# EAGLE design DTB_BLDC_Power_Board_v2 (EAGLE 9.6.2)
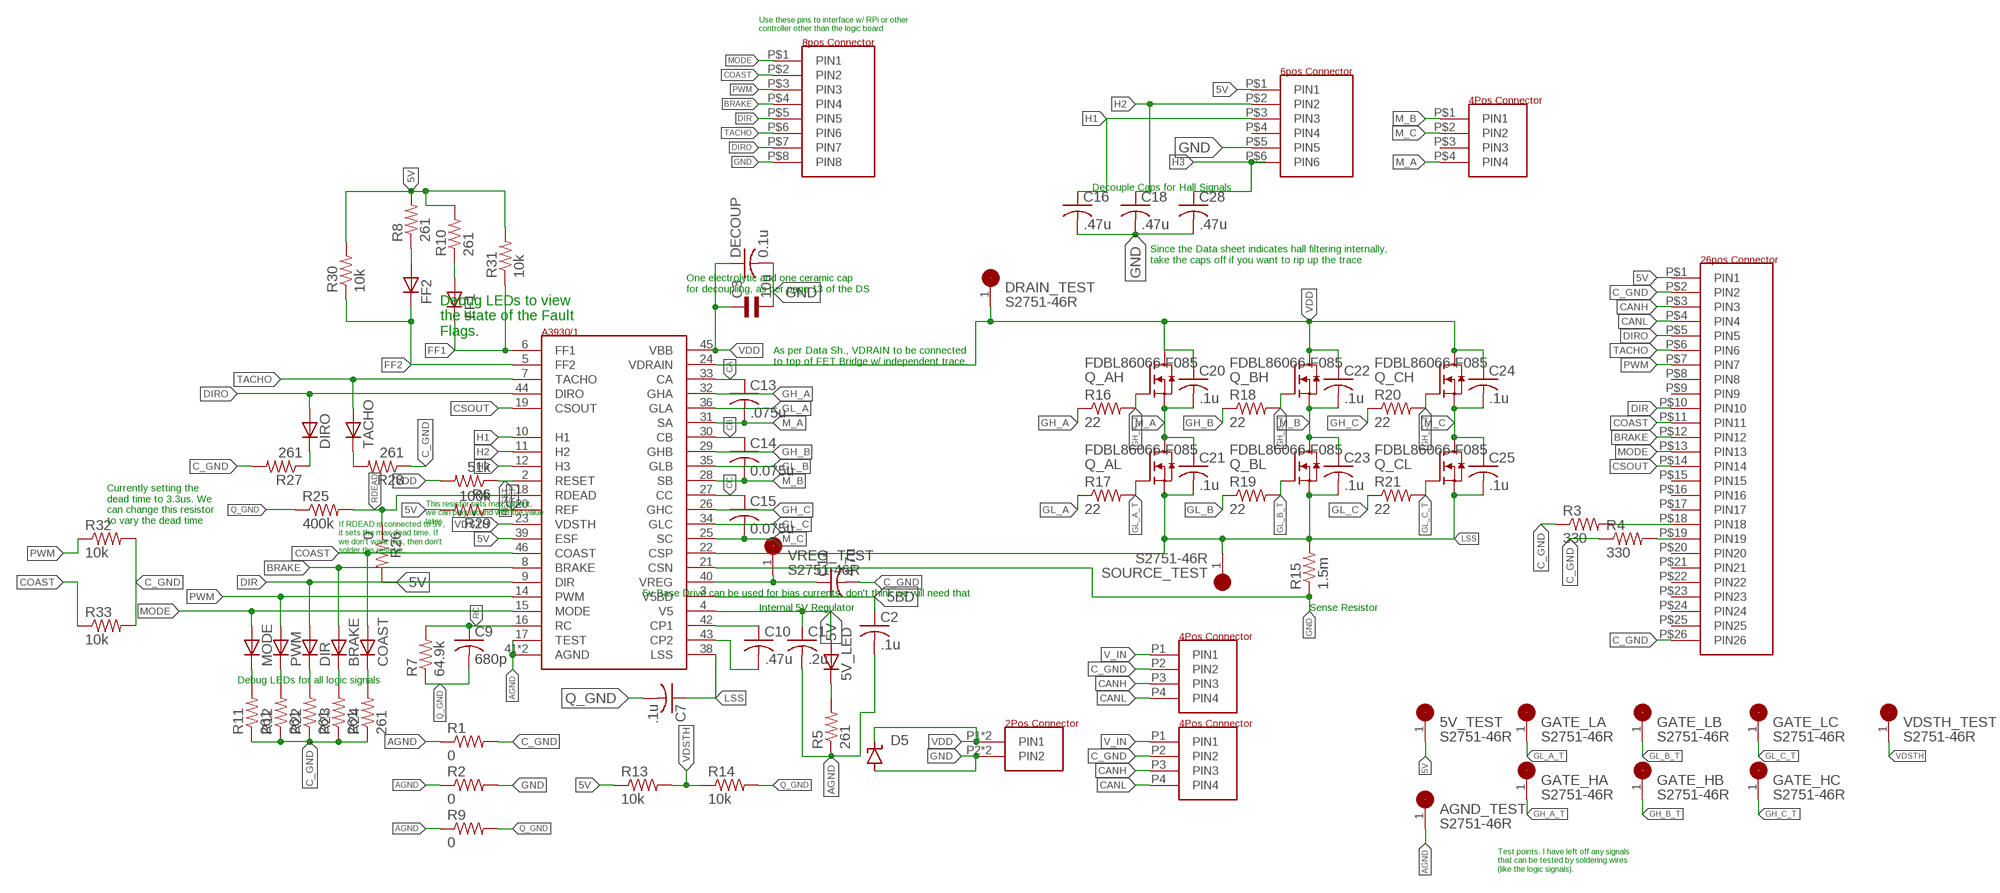
[diagram p0: schematic, sheet 1]

## Parts
5V_LED  LED0603  [DO0603]
5V_TEST  S2751-46R  [HARWIN_S2751-46R]
AGND_TEST  S2751-46R  [HARWIN_S2751-46R]
BRAKE  LED0603  [DO0603]
C1  .2u  C-USC1206K  [C1206K]
C2  .1u  C-USC1206K  [C1206K]
C3  10u  EL-BI25-10AXIAL  [EU25-10]
C7  .1u  C-USC0603  [C0603]
C9  680p  C-USC0603K  [C0603K]
C10  .47u  C-USC1206K  [C1206K]
C11  4.7u  C-USC1206K  [C1206K]
C13  .075u  C-USC1206K  [C1206K]
C14  0.075u  C-USC1206K  [C1206K]
C15  0.075u  C-USC1206K  [C1206K]
C16  .47u  C-USC0603K  [C0603K]
C18  .47u  C-USC0603K  [C0603K]
C20  .1u  C-USC1206K  [C1206K]
C21  .1u  C-USC1206K  [C1206K]
C22  .1u  C-USC1206K  [C1206K]
C23  .1u  C-USC1206K  [C1206K]
C24  .1u  C-USC1206K  [C1206K]
C25  .1u  C-USC1206K  [C1206K]
C28  .47u  C-USC0603K  [C0603K]
COAST  LED0603  [DO0603]
D5  SUPPRESSOR-SMBJ  [SMBJ]
DECOUP  0.1u  C-USC0603K  [C0603K]
DIR  LED0603  [DO0603]
DIRO  LED0603  [DO0603]
DRAIN_TEST  S2751-46R  [HARWIN_S2751-46R]
FF1  LED0603  [DO0603]
FF2  LED0603  [DO0603]
GATE_HA  S2751-46R  [HARWIN_S2751-46R]
GATE_HB  S2751-46R  [HARWIN_S2751-46R]
GATE_HC  S2751-46R  [HARWIN_S2751-46R]
GATE_LA  S2751-46R  [HARWIN_S2751-46R]
GATE_LB  S2751-46R  [HARWIN_S2751-46R]
GATE_LC  S2751-46R  [HARWIN_S2751-46R]
J1  26POS_CONNECTORN2526-6002-RB  [N2526-6002-RB]
J2  4POS_MOLEX_MEGAFIT5.7  [MOLEX_MEGAFIT5.7_1720650204]
J3  6POS_MOLEX_MINIFIT4.2  [MOLEX_MINIFIT4.2_0460150606]
J4  4POS_CONNECTORMOLEX_MICROFIT3.0_0430450412  [MOLEX_MICROFIT3.0_0430450412]
J5  4POS_CONNECTORMOLEX_MICROFIT3.0_0430450412  [MOLEX_MICROFIT3.0_0430450412]
J6  2POS_CONNECTORPOWERPOLE_45_1X2_VERT  [POWERPOLE_45A_1X2_VERT]
MODE  LED0603  [DO0603]
PWM  LED0603  [DO0603]
Q_AH  FDBL86066-F085  N-FETPG-HSOF-8-1  [PG-HSOF-8-1]
Q_AL  FDBL86066-F085  N-FETPG-HSOF-8-1  [PG-HSOF-8-1]
Q_BH  FDBL86066-F085  N-FETPG-HSOF-8-1  [PG-HSOF-8-1]
Q_BL  FDBL86066-F085  N-FETPG-HSOF-8-1  [PG-HSOF-8-1]
Q_CH  FDBL86066-F085  N-FETPG-HSOF-8-1  [PG-HSOF-8-1]
Q_CL  FDBL86066-F085  N-FETPG-HSOF-8-1  [PG-HSOF-8-1]
R1  0  R-US_R1206  [R1206]
R2  0  R-US_R1206  [R1206]
R3  330  R-US_R0603  [R0603]
R4  330  R-US_R0603  [R0603]
R5  261  R-US_R0603  [R0603]
R6  51k  R-US_R0603  [R0603]
R7  64.9k  R-US_R0603  [R0603]
R8  261  R-US_R0603  [R0603]
R9  0  R-US_R1206  [R1206]
R10  261  R-US_R0603  [R0603]
R11  261  R-US_R0603  [R0603]
R12  261  R-US_R0603  [R0603]
R13  10k  R-US_R0603  [R0603]
R14  10k  R-US_R0603  [R0603]
R15  1.5m  R-US_R2512  [R2512]
R16  22  R-US_R1206  [R1206]
R17  22  R-US_R1206  [R1206]
R18  22  R-US_R1206  [R1206]
R19  22  R-US_R1206  [R1206]
R20  22  R-US_R1206  [R1206]
R21  22  R-US_R1206  [R1206]
R22  261  R-US_R0603  [R0603]
R23  261  R-US_R0603  [R0603]
R24  261  R-US_R0603  [R0603]
R25  400k  R-US_R0603  [R0603]
R26  0  R-US_R0603  [R0603]
R27  261  R-US_R0603  [R0603]
R28  261  R-US_R0603  [R0603]
R29  100k  R-US_R0603  [R0603]
R30  10k  R-US_R0603  [R0603]
R31  10k  R-US_R0603  [R0603]
R32  10k  R-US_R0603  [R0603]
R33  10k  R-US_R0603  [R0603]
SOURCE_TEST  S2751-46R  [HARWIN_S2751-46R]
TACHO  LED0603  [DO0603]
U1  A3930/1  [QFP50P900X900X160-49T500]
U$13  8POS_CONNECTOR8POS_HEADER_0.1"  [8POS_HEADER_.1"]
VDSTH_TEST  S2751-46R  [HARWIN_S2751-46R]
VREG_TEST  S2751-46R  [HARWIN_S2751-46R]

## Nets
5BD: C2.1 U1.3(V5BD)
5V: 5V_LED.1(A) 5V_TEST.1(TP) C1.1 J1.P$1(PIN1) J3.P$1(PIN1) R8.2 R10.2 R13.1 R26.2 R29.2 R30.2 R31.2 U1.4(V5) U1.39(ESF)
AGND: AGND_TEST.1(TP) C1.2 C2.2 R1.1 R2.1 R5.1 R9.1 U1.17(TEST) U1.41(AGND) U1.49(AGND)
BRAKE: BRAKE.1(A) J1.P$12(PIN12) U1.8(BRAKE) U$13.P$4(PIN4)
C_GND: C11.2 J1.P$2(PIN2) J1.P$26(PIN26) J4.P2(PIN2) J5.P2(PIN2) R1.2 R3.1 R4.1 R11.1 R12.1 R22.1 R23.1 R24.1 R27.2 R28.1 R32.2 R33.2
CA: C13.1 U1.33(CA)
CANH: J1.P$3(PIN3) J4.P3(PIN3) J5.P3(PIN3)
CANL: J1.P$4(PIN4) J4.P4(PIN4) J5.P4(PIN4)
CB: C14.1 U1.30(CB)
CC: C15.1 U1.27(CC)
COAST: COAST.1(A) J1.P$11(PIN11) R33.1 U1.46(COAST) U$13.P$2(PIN2)
CSOUT: J1.P$14(PIN14) U1.19(CSOUT)
DIR: DIR.1(A) J1.P$10(PIN10) U1.9(DIR) U$13.P$5(PIN5)
DIRO: DIRO.1(A) J1.P$5(PIN5) U1.44(DIRO) U$13.P$7(PIN7)
FF1: FF1.2(C) R31.1 U1.6(FF1)
FF2: FF2.2(C) R30.1 U1.5(FF2)
GH_A: R16.1 U1.32(GHA)
GH_A_T: GATE_HA.1(TP) Q_AH.P$4(G) R16.2
GH_B: R18.1 U1.29(GHB)
GH_B_T: GATE_HB.1(TP) Q_BH.P$4(G) R18.2
GH_C: R20.1 U1.26(GHC)
GH_C_T: GATE_HC.1(TP) Q_CH.P$4(G) R20.2
GL_A: R17.1 U1.36(GLA)
GL_A_T: GATE_LA.1(TP) Q_AL.P$4(G) R17.2
GL_B: R19.1 U1.35(GLB)
GL_B_T: GATE_LB.1(TP) Q_BL.P$4(G) R19.2
GL_C: R21.1 U1.34(GLC)
GL_C_T: GATE_LC.1(TP) Q_CL.P$4(G) R21.2
GND: C3.2 C16.2 C18.2 C28.2 D5.A DECOUP.2 J3.P$5(PIN5) J6.P2(PIN2) J6.P2B(PIN2) R2.2 R15.1 U1.21(CSN) U$13.P$8(PIN8)
H1: C16.1 J3.P$3(PIN3) U1.10(H1)
H2: C18.1 J3.P$2(PIN2) U1.11(H2)
H3: C28.1 J3.P$6(PIN6) U1.12(H3)
LSS: C7.1 C21.2 C23.2 C25.2 Q_AL.P$5(S) Q_AL.P$6(S) Q_AL.P$7(S) Q_AL.P$8(S) Q_AL.P$9(S) Q_AL.P$10(S) Q_AL.P$11(S) Q_AL.P$12(S) Q_BL.P$5(S) Q_BL.P$6(S) Q_BL.P$7(S) Q_BL.P$8(S) Q_BL.P$9(S) Q_BL.P$10(S) Q_BL.P$11(S) Q_BL.P$12(S) Q_CL.P$5(S) Q_CL.P$6(S) Q_CL.P$7(S) Q_CL.P$8(S) Q_CL.P$9(S) Q_CL.P$10(S) Q_CL.P$11(S) Q_CL.P$12(S) R15.2 SOURCE_TEST.1(TP) U1.22(CSP) U1.38(LSS)
M_A: C13.2 C20.2 C21.1 J2.P$4(PIN4) Q_AH.P$5(S) Q_AH.P$6(S) Q_AH.P$7(S) Q_AH.P$8(S) Q_AH.P$9(S) Q_AH.P$10(S) Q_AH.P$11(S) Q_AH.P$12(S) Q_AL.P$1(D) Q_AL.P$2(D) Q_AL.P$3(D) U1.31(SA)
M_B: C14.2 C22.2 C23.1 J2.P$1(PIN1) Q_BH.P$5(S) Q_BH.P$6(S) Q_BH.P$7(S) Q_BH.P$8(S) Q_BH.P$9(S) Q_BH.P$10(S) Q_BH.P$11(S) Q_BH.P$12(S) Q_BL.P$1(D) Q_BL.P$2(D) Q_BL.P$3(D) U1.28(SB)
M_C: C15.2 C24.2 C25.1 J2.P$2(PIN2) Q_CH.P$5(S) Q_CH.P$6(S) Q_CH.P$7(S) Q_CH.P$8(S) Q_CH.P$9(S) Q_CH.P$10(S) Q_CH.P$11(S) Q_CH.P$12(S) Q_CL.P$1(D) Q_CL.P$2(D) Q_CL.P$3(D) U1.25(SC)
MODE: J1.P$13(PIN13) MODE.1(A) U1.15(MODE) U$13.P$1(PIN1)
N$1: J1.P$18(PIN18) R3.2
N$2: J1.P$19(PIN19) R4.2
N$3: C10.1 U1.42(CP1)
N$4: C10.2 U1.43(CP2)
N$5: FF1.1(A) R10.1
N$13: 5V_LED.2(C) R5.2
N$18: FF2.1(A) R8.1
N$22: DIRO.2(C) R27.1
N$23: R28.2 TACHO.2(C)
N$24: MODE.2(C) R11.2
N$25: PWM.2(C) R12.2
N$26: DIR.2(C) R22.2
N$27: BRAKE.2(C) R23.2
N$28: COAST.2(C) R24.2
PWM: J1.P$7(PIN7) PWM.1(A) R32.1 U1.14(PWM) U$13.P$3(PIN3)
Q_GND: C7.2 C9.2 R7.1 R9.2 R14.2 R25.1
RC: C9.1 R7.2 U1.16(RC)
RDEAD: R25.2 R26.1 U1.18(RDEAD)
REF: R29.1 U1.20(REF)
RESET: R6.1 U1.2(RESET)
TACHO: J1.P$6(PIN6) TACHO.1(A) U1.7(TACHO) U$13.P$6(PIN6)
V_IN: J4.P1(PIN1) J5.P1(PIN1)
VDD: C3.1 C20.1 C22.1 C24.1 D5.C DECOUP.1 DRAIN_TEST.1(TP) J6.P1(PIN1) J6.P1B(PIN1) Q_AH.P$1(D) Q_AH.P$2(D) Q_AH.P$3(D) Q_BH.P$1(D) Q_BH.P$2(D) Q_BH.P$3(D) Q_CH.P$1(D) Q_CH.P$2(D) Q_CH.P$3(D) R6.2 U1.24(VDRAIN) U1.45(VBB)
VDSTH: R13.2 R14.1 U1.23(VDSTH) VDSTH_TEST.1(TP)
VREG: C11.1 U1.40(VREG) VREG_TEST.1(TP)
Unconnected: J1.P$8(PIN8) J1.P$9(PIN9) J1.P$15(PIN15) J1.P$16(PIN16) J1.P$17(PIN17) J1.P$20(PIN20) J1.P$21(PIN21) J1.P$22(PIN22) J1.P$23(PIN23) J1.P$24(PIN24) J1.P$25(PIN25) J2.P$3(PIN3) J3.P$4(PIN4)

## Notes on the sheet
- Use these pins to interface w/ RPi or other
  controller other than the logic board
- Decouple Caps for Hall Signals
- Since the Data sheet indicates hall filtering internally, 
  take the caps off if you want to rip up the trace
- One electrolytic and one ceramic cap
  for decoupling, as per page 13 of the DS
- Debug LEDs to view
  the state of the Fault
  Flags.
- As per Data Sh., VDRAIN to be connected
  to top of FET Bridge w/ independent trace.
- Currently setting the 
  dead time to 3.3us. We
  can change this resistor
  to vary the dead time
- This resistor sets max current,
  we can play around with the value
  later
- If RDEAD is connected to 5V,
  it sets the max dead time. If
  we don't want this, then don't
  solder this resistor.
- 5v Base Drive can be used for bias currents, don't think we will need that
- Internal 5V Regulator | Sense Resistor
- Debug LEDs for all logic signals
- Test points. I have left off any signals
  that can be tested by soldering wires
  (like the logic signals).

## Library data of the parts
5V_LED BRAKE COAST DIR DIRO FF1 FF2 MODE PWM TACHO = CMR:LED0603: LED size 0603 for debugging pic
5V_TEST AGND_TEST DRAIN_TEST GATE_HA GATE_HB GATE_HC GATE_LA GATE_LB GATE_LC SOURCE_TEST VDSTH_TEST VREG_TEST = CMR:S2751-46R: EZ-Test Point, SMT, tin, Tape and Reeled Check prices <https://pricing.snapeda.com/parts/S2751-46R/Harwin%20Inc./view-part?ref=eda>; AVAILABILITY: In Stock; DESCRIPTION: Natural PC Test Point Brass, Tin Plating Surface Mount Mounting Type; MF: Harwin Inc.; MP: S2751-46R; PACKAGE: None; PRICE: None; PURCHASE-URL: https://pricing.snapeda.com/search/part/S2751-46R/?ref=eda
C1 C2 C7 C9-C11 C13-C16 C18 C20-C25 C28 DECOUP = rcl:C-US: CAPACITOR, American symbol; SPICEPREFIX: C
C3 = rcl:EL-: BIPOLAR ELECTROLYTIC CAPACITOR; SPICEPREFIX: C
D5 = diode:SUPPRESSOR-: Suppressor diode
J1 = CMR:26POS_CONNECTOR
J2 = CMR:4POS_MOLEX_MEGAFIT5.7
J3 = CMR:6POS_MOLEX_MINIFIT4.2
J4 J5 = CMR:4POS_CONNECTOR: 4 position connector could be header or connector
J6 = CMR:2POS_CONNECTOR: Harwin 2mm 2 POS Connector Male - https://www.digikey.com/product-detail/en/harwin-inc/M80-8520242/952-1769-ND/3727738 Female - https://www.digikey.com/product-detail/en/harwin-inc/M80-8980205/952-1182-ND/2264171
Q_AH Q_AL Q_BH Q_BL Q_CH Q_CL = CMR:N-FET: 150A MOSFET (probably can't sustain the 150A continuous)
R1-R33 = rcl:R-US_: RESISTOR, American symbol; SPICEPREFIX: R
U1 = CMR:A3930/1
U$13 = CMR:8POS_CONNECTOR: Arbitrary 8 position connector

## Board
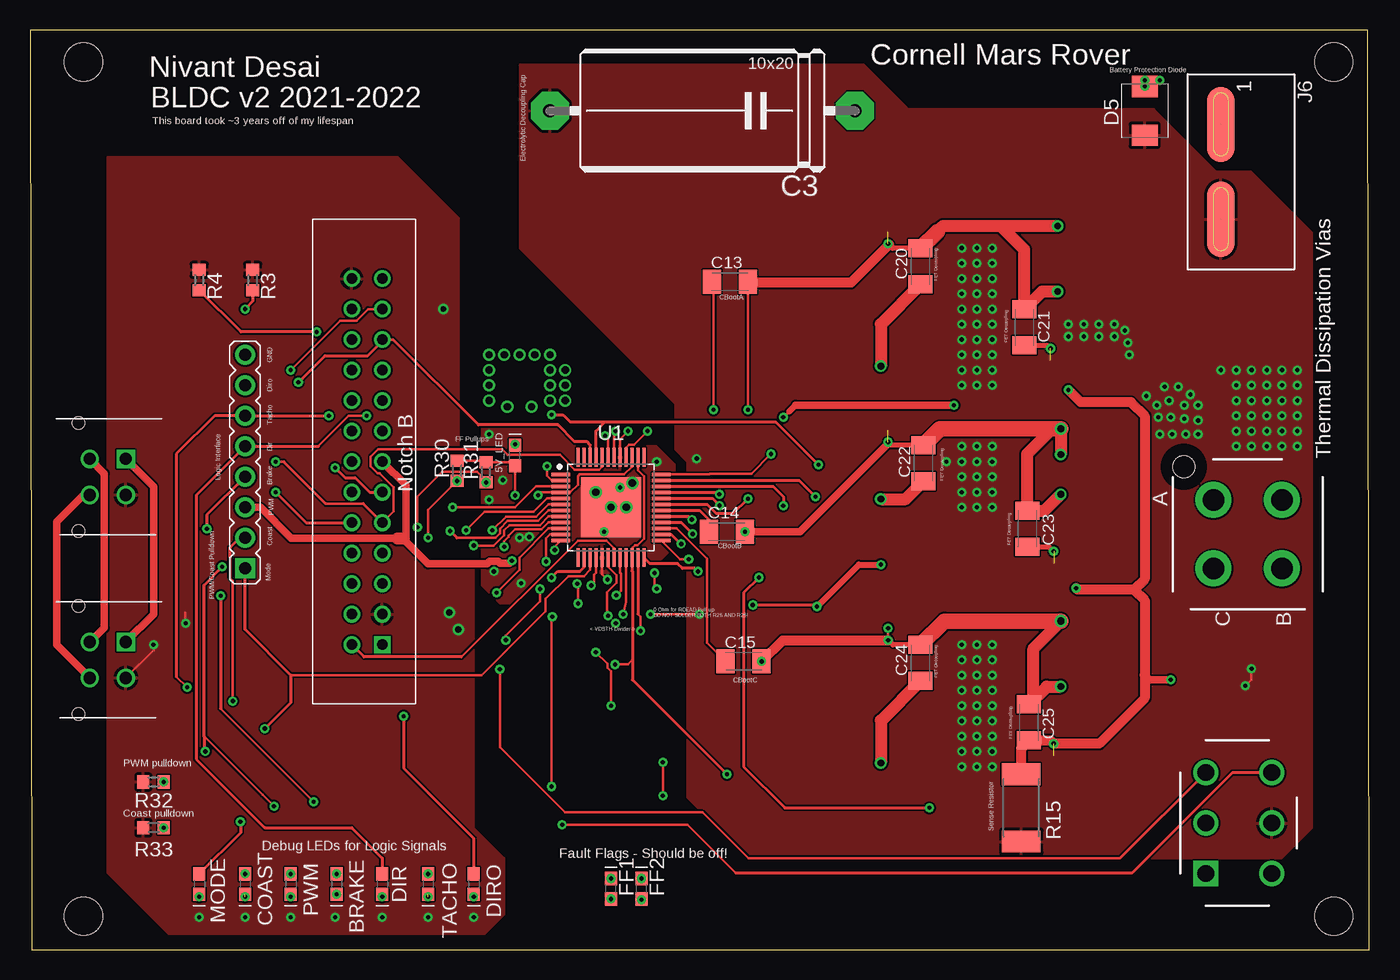
[diagram p1: board, top side]
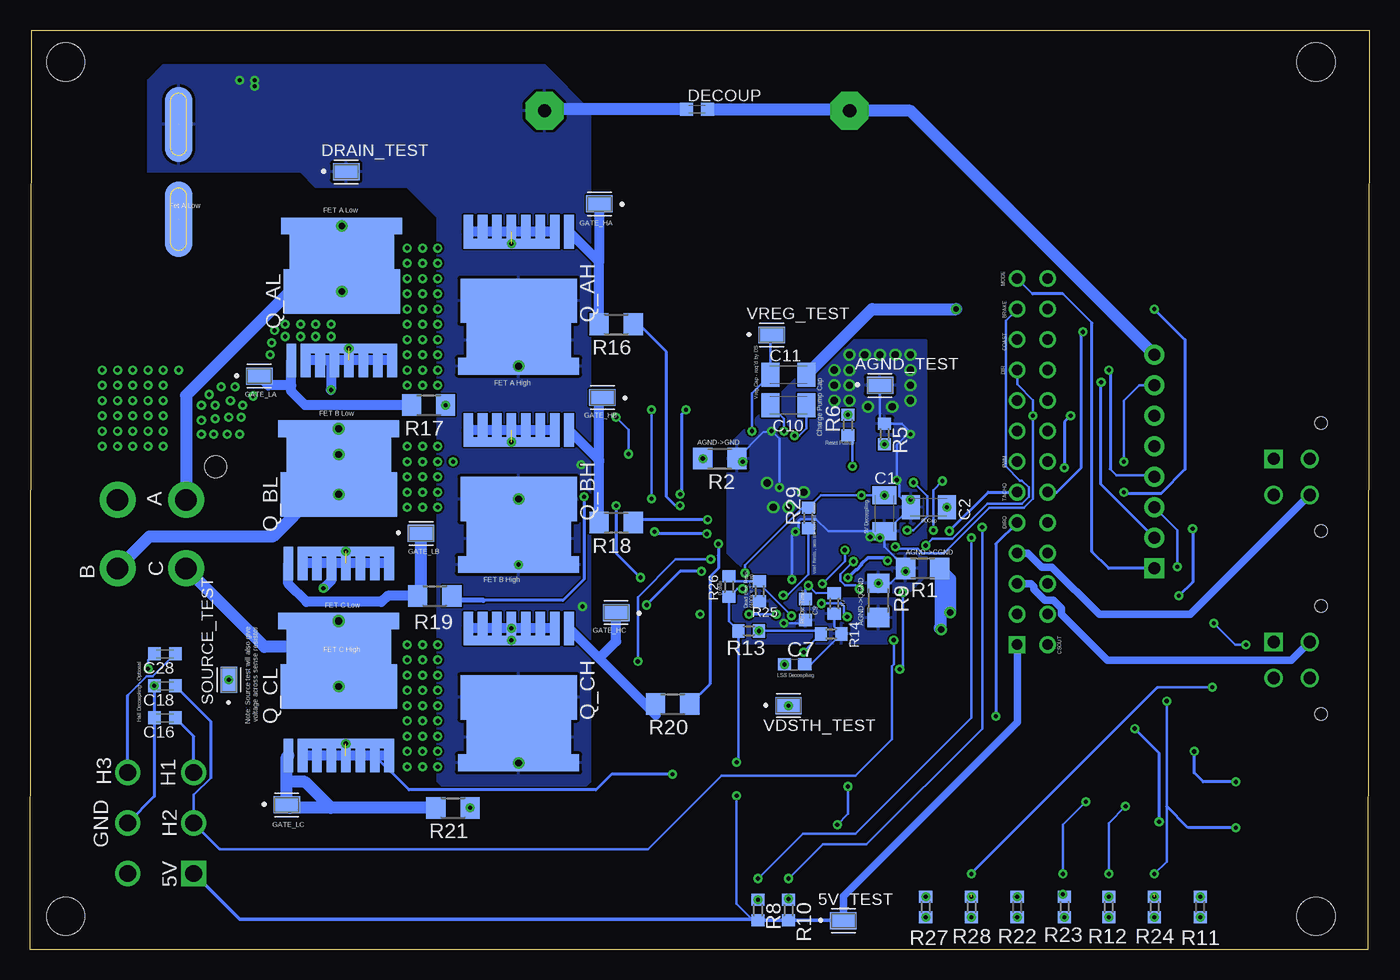
[diagram p2: board, bottom side, seen from below]

Size 111.56 x 76.57 mm. Coordinates in mm from the lower left corner, seen from the top.
Outline: 0.13,0 111.56,0 111.43,76.57 0,76.57 0.13,0
Copper layers (1*16): Top 0.035mm / dielectric 1.5mm / Bottom 0.035mm
Design rules "default": minimum track width 6mil, minimum drill 0.35mm, track to track 6mil, track to pad 6mil, pad to pad 6mil, via to via 6mil, smd to smd 6mil, copper to edge 40mil, drill to drill 6mil, minimum pad ring 10mil, minimum via ring 8mil, stop-mask expansion 4mil, vias tented up to drill 0mil, thermal gap 10mil
Holes 3.17 mm at 4.44,73.91 4.44,2.79 108.58,2.79 108.58,73.91

### Footprints (pad centres in the part's own frame; a part is rotated, then mirrored left to right if it is on the bottom)
DO0603 = smd 1.1 x 1: 1 -0.85,0; 2 0.85,0
HARWIN_S2751-46R = smd 2.2 x 1.4: 1 0,0
C1206K = smd 1.5 x 2: 1 -1.5,0; 2 1.5,0
EU25-10 = drill 1.118 pad 3.15 octagon: 1 -12.7,0; 2 12.7,0
C0603 = smd 1.1 x 1: 1 -0.85,0; 2 0.85,0
C0603K = smd 1.05 x 1.08: 1 -0.875,0; 2 0.875,0
SMBJ = smd 1.78 x 2.16: A 2.04,0; C -2.03,0
N2526-6002-RB = drill 0.889 square: P$1 0,0 | drill 0.889: P$2 2.54,0; P$3 5.08,0; P$4 7.62,0; P$5 10.16,0; P$6 12.7,0; P$7 15.24,0; P$8 17.78,0; P$9 20.32,0; P$10 22.86,0; P$11 25.4,0; P$12 27.94,0; P$13 30.48,0; P$14 0,2.54; P$15 2.54,2.54; P$16 5.08,2.54; P$17 7.62,2.54; P$18 10.16,2.54; P$19 12.7,2.54; P$20 15.24,2.54; P$21 17.78,2.54; P$22 20.32,2.54; P$23 22.86,2.54; P$24 25.4,2.54; P$25 27.94,2.54; P$26 30.48,2.54
MOLEX_MEGAFIT5.7_1720650204 = drill 1.8 pad 3: P$1 0,0; P$2 5.7,0; P$3 0,-5.7; P$4 5.7,-5.7 | hole 1.8: 8.18,-8.47
MOLEX_MINIFIT4.2_0460150606 = drill 1.4 square: P$1 0,0 | drill 1.4: P$2 4.2,0; P$3 8.4,0; P$4 0,-5.5; P$5 4.2,-5.5; P$6 8.4,-5.5
MOLEX_MICROFIT3.0_0430450412 = drill 1.02 square: P1 1.5,-1.5 | drill 1.02: P2 -1.5,-1.5; P3 1.5,1.5; P4 -1.5,1.5 | hole 1.02: -4.5,2.44; 4.5,2.44
POWERPOLE_45A_1X2_VERT = smd 6.246 x 2.286: P1 -3.95,0; P2 3.95,0 | smd 6.246 x 2.286 bottom: P1B -3.95,0; P2B 3.95,0
PG-HSOF-8-1 = smd 10.1 x 1.4: P$1 0,7.3 | smd 8.7 x 2.9: P$2 0,5.15 | smd 9.7 x 3.7: P$3 0,1.85 | smd 0.8 x 2.8: P$4 -4.2,-3.9; P$5 -3,-3.9; P$6 -1.8,-3.9; P$7 -0.6,-3.9; P$8 0.6,-3.9; P$9 1.8,-3.9; P$10 3,-3.9; P$11 4.2,-3.9 | smd 8 x 0.8: P$12 0.6,-2.9
R1206 = smd 1.6 x 1.803: 1 -1.422,0; 2 1.422,0
R0603 = smd 1 x 1.1: 1 -0.85,0; 2 0.85,0
R2512 = smd 1.8 x 3.2: 1 -2.8,0; 2 2.8,0
QFP50P900X900X160-49T500 = smd 1.559 x 0.28: 1 -4.178,2.75; 2 -4.178,2.25; 3 -4.178,1.75; 4 -4.178,1.25; 5 -4.178,0.75; 6 -4.178,0.25; 7 -4.178,-0.25; 8 -4.178,-0.75; 9 -4.178,-1.25; 10 -4.178,-1.75; 11 -4.178,-2.25; 12 -4.178,-2.75; 25 4.178,-2.75; 26 4.178,-2.25; 27 4.178,-1.75; 28 4.178,-1.25; 29 4.178,-0.75; 30 4.178,-0.25; 31 4.178,0.25; 32 4.178,0.75; 33 4.178,1.25; 34 4.178,1.75; 35 4.178,2.25; 36 4.178,2.75 | smd 0.28 x 1.559: 13 -2.75,-4.178; 14 -2.25,-4.178; 15 -1.75,-4.178; 16 -1.25,-4.178; 17 -0.75,-4.178; 18 -0.25,-4.178; 19 0.25,-4.178; 20 0.75,-4.178; 21 1.25,-4.178; 22 1.75,-4.178; 23 2.25,-4.178; 24 2.75,-4.178; 37 2.75,4.178; 38 2.25,4.178; 39 1.75,4.178; 40 1.25,4.178; 41 0.75,4.178; 42 0.25,4.178; 43 -0.25,4.178; 44 -0.75,4.178; 45 -1.25,4.178; 46 -1.75,4.178; 47 -2.25,4.178; 48 -2.75,4.178 | smd 5 x 5: 49 0,0
8POS_HEADER_.1" = drill 0.991 pad 1.676 square: P$1 0,0 | drill 0.991 pad 1.676: P$2 2.54,0; P$3 5.08,0; P$4 7.62,0; P$5 10.16,0; P$6 12.7,0; P$7 15.24,0; P$8 17.78,0

### Placement (x,y rotation side)
5V_LED  40.39,41.15 90 top
5V_TEST  43.82,2.41 0 bottom
AGND_TEST  40.77,46.99 0 bottom
BRAKE  25.53,5.46 270 top
C1  40.39,36.32 270 bottom
C2  36.7,36.83 180 bottom
C3  56.01,69.85 180 top
C7  47.88,23.75 0 bottom
C9  46.99,28.32 270 bottom
C10  48.39,45.34 0 bottom
C11  48.39,47.88 0 bottom
C13  58.29,55.63 0 top
C14  58.04,34.8 0 top
C15  59.44,24 0 top
C16  100.33,19.3 180 bottom
C18  100.33,21.97 180 bottom
C20  74.17,56.9 90 top
C21  82.8,51.82 270 top
C22  74.42,40.51 90 top
C23  83.06,35.05 270 top
C24  74.17,23.88 90 top
C25  83.19,18.92 270 top
C28  100.33,24.64 180 bottom
COAST  17.91,5.46 270 top
D5  92.84,69.85 270 top
DECOUP  56.01,69.98 0 bottom
DIR  29.34,5.46 270 top
DIRO  36.96,5.46 270 top
DRAIN_TEST  85.22,64.77 0 bottom
FF1  48.39,5.08 90 top
FF2  50.93,5.08 90 top
GATE_HA  64.13,62.1 180 bottom
GATE_HB  63.88,45.97 180 bottom
GATE_HC  62.74,28.07 180 bottom
GATE_LA  92.46,47.75 0 bottom
GATE_LB  78.99,34.67 0 bottom
GATE_LC  90.17,12.06 0 bottom
J1  29.34,25.4 90 top
J2  104.27,31.75 180 top
J3  97.92,6.35 90 top
J4  6.48,24.13 90 top
J5  6.48,39.37 90 top
J6  99.19,64.77 270 top
MODE  14.1,5.46 270 top
PWM  21.72,5.46 270 top
Q_AH  70.87,55.88 180 bottom
Q_AL  85.6,52.96 0 bottom
Q_BH  70.87,39.37 180 bottom
Q_BL  85.85,36.07 0 bottom
Q_CH  70.87,22.86 180 bottom
Q_CL  85.85,20.07 0 bottom
R1  37.21,31.75 0 bottom
R2  54.1,40.89 180 bottom
R3  18.54,55.75 270 top
R4  14.1,55.75 270 top
R5  40.39,42.93 270 bottom
R6  43.43,43.69 90 bottom
R7  44.58,28.83 90 bottom
R8  50.93,3.3 270 bottom
R9  40.89,29.08 270 bottom
R10  48.39,3.3 270 bottom
R11  14.1,3.56 90 bottom
R12  21.72,3.56 90 bottom
R13  51.69,26.54 0 bottom
R14  44.83,26.29 0 bottom
R15  82.55,11.81 90 top
R16  62.74,52.07 180 bottom
R17  78.36,45.34 180 bottom
R18  62.74,35.56 180 bottom
R19  77.85,29.46 180 bottom
R20  58.04,20.45 180 bottom
R21  76.33,11.81 180 bottom
R22  29.34,3.56 90 bottom
R23  25.4,3.56 90 bottom
R24  17.91,3.56 90 bottom
R25  50.8,29.84 90 bottom
R26  53.34,30.23 270 bottom
R27  36.96,3.56 270 bottom
R28  33.15,3.56 90 bottom
R29  46.74,35.94 90 bottom
R30  35.56,39.88 90 top
R31  37.97,39.75 90 top
R32  10.29,13.97 180 top
R33  10.29,10.16 180 top
SOURCE_TEST  95,22.48 90 bottom
TACHO  33.15,5.46 270 top
U1  48.39,36.83 0 top
U$13  17.91,31.75 90 top
VDSTH_TEST  48.39,20.32 0 bottom
VREG_TEST  49.78,51.18 0 bottom

### Tracks (layer width: path | path; a pad name or v marks a point on that pad's centre or on a via)
5BD  (via drill 0.35)
  Top 0.203: U1.3 42.16,38.58 40.41,36.83 C2.1
  other vias: 35.2,36.83
5V  (via drill 0.35)
  Top 0.203: v42.32,37.84 42.55,38.08 U1.4 44.99,38.08 45.63,38.73 45.63,39.44 45.78,39.58 49.49,39.58 50.14,40.23 U1.39 | C1.1 5V_LED.1 40.08,40.6 38.23,40.6 | R31.2 38.23,40.6 | R30.2 38.1,40.73 38.23,40.6 | v52.2,30.06 52.01,30.25 v52.01,31.37 | v52.71,15.62 v52.71,12.83
  Bottom 0.203: C1.1 40.41,37.84 v42.32,37.84 45.69,37.84 R29.2 47.22,36.79 52.01,32 v52.01,31.37 | v52.2,30.06 52.65,30.06 R26.2 53.34,27.34 R13.1 52.54,15.79 v52.71,15.62 | v52.71,12.83 52.71,3.81 51.44,2.54
  Bottom 0.305: J3.P$1 94.11,2.54 51.44,2.54 51.02,2.54 R8.2 R10.2 43.85,2.45 5V_TEST.1
  Bottom 0.61: 5V_TEST.1 43.82,4.45 29.34,18.92 J1.P$1
  other vias: 40.39,37.82
AGND  (via drill 0.35, 0.6)
  Top 0.203: U1.17 47.64,31.28 v48.09,30.83 | U1.41 49.14,42.51 v49.8,43.18
  Bottom 0.152: R9.1 40.89,31.11 | R2.1 50.47,43.11 49.73,43.11
  Bottom 0.203: 38.35,43.05 v38.23,42.93 | C2.2 38.23,36.85 v38.23,37.46 | C1.2 40.77,34.44 v40.77,34.29 | R1.1 v38.63,31.5 | R2.1 52.45,40.89 v52.2,40.64 | AGND_TEST.1 40.77,44.16 R5.1 38.95,43.78 38.29,43.12 38.35,43.05 | v48.09,30.83 48.09,34.52 v47.82,34.8 47.54,35.08 47.54,35.7 47.39,35.84 46.08,35.84 45.06,34.82 C1.2 | C1.2 40.84,34.37 v41.58,34.37 | v49.8,43.18 49.73,43.11 49.15,42.52 v49.15,38.48 | C2.2 39.13,37.76 39.13,38.68 39.37,38.91 v39.37,39.1 39.37,42.04 38.35,43.05 | R1.1 39.88,30.5 R9.1 | R1.1 39.5,32.62 39.5,32.65 40.39,33.53 C1.2 | C2.2 40.21,34.82 C1.2
  other vias: 40.89,30.5 38.23,49.53 38.23,48.26 38.23,46.99 38.23,45.72 39.75,45.21 41.78,45.21 43.31,45.72 44.58,45.72 43.31,46.99 44.58,46.99 44.58,48.26 43.31,48.26 43.31,49.53 42.04,49.53 40.77,49.53 39.5,49.53 48.39,36.83 47.12,38.1 49.66,36.83 50.16,38.86
  pour Top: 52.2,41.91 45.85,41.91 43.31,44.45 38.23,44.45 37.59,43.81 37.59,40.77 37.59,30.35 39.12,28.83 42.16,28.83 44.7,31.37 51.44,31.37 53.72,33.66 53.72,40.39
  pour Bottom: 36.96,50.8 36.96,31.11 38.35,29.72 43.05,29.72 44.58,31.24 51.69,31.24 53.47,33.02 53.47,41.91 52.2,43.18 44.58,50.8
BRAKE  (via drill 0.35)
  Top 0.203: v36.96,33.66 38.63,33.66 39.49,34.52 39.49,34.91 39.94,35.36 42.46,35.36 43.18,36.08 U1.8 | J1.P$12 28.14,53.34 27.19,52.39 25.84,52.39 v21.72,48.26 | 15.88,20.07 v23.62,12.32
  Top 0.254: U$13.P$4 14.73,36.2 v14.73,35.05 | v15.88,29.46 15.88,20.07
  Bottom 0.203: v36.96,33.66 36.38,34.23 34.73,34.23 31.81,37.15 28.94,37.15 28.38,37.7 28.38,38.49 28.94,39.05 29.1,39.05 30.29,40.24 30.29,52.39 J1.P$12 | U$13.P$4 18.03,39.5 21.08,39.5 21.59,40.01 | v23.62,12.32 25.53,10.41 BRAKE.1
  Bottom 0.254: v21.72,48.26 21.59,48.13 21.59,40.01 | v14.73,35.05 14.73,30.61 v15.88,29.46
  other vias: 25.53,6.31
C_GND  (via drill 0.35, 0.45, 0.55)
  Top 0.203: 12.94,28.05 12.94,27.19 v12.95,27.18 | v10.29,25.4 10.29,24.94 J4.P2
  Bottom 0.203: v12.95,27.18 11.18,25.4 v10.29,25.4
  Bottom 1.016: C11.2 41.43,53.34 v34.42,53.34 | v34.93,28.07 34.93,30.89 R1.2 35.69,31.65 v35.69,26.67 35.79,26.77
  other vias: 14.1,2.71 17.91,2.71 21.72,2.71 25.4,2.71 29.34,2.71 33.15,2.71 36.96,2.71
  pour Top: 36.96,34.29 36.96,10.16 39.5,7.62 39.5,2.92 38.35,1.78 37.85,1.27 11.56,1.27 6.48,6.35 6.48,66.04 30.61,66.04 35.69,60.96 35.69,35.56
CA  (via drill 0.35)
  Top 0.203: v56.92,44.96 56.92,55.5 C13.1
  Top 0.254: U1.33 57.25,38.08 v57.41,37.92
  Bottom 0.254: v56.92,44.96 57.28,44.6 57.28,38.05 v57.41,37.92
CANH
  Top 0.61: J4.P3 5.02,25.63 6.2,26.81 6.2,39.65 J5.P3
  Bottom 0.61: J1.P$3 28.19,30.48 27.95,30.24 27.95,30 27.05,29.1 26.32,29.1 25.64,28.42 25.64,27.93 21.82,24.11 6.5,24.11 J4.P3
CANL
  Top 0.61: J5.P4 4.88,37.97 4.55,37.97 2.21,35.63 2.21,25.4 3.45,24.16 3.45,24.15 J4.P4
  Bottom 0.61: J1.P$4 28.43,33.02 27.28,31.86 26.43,31.86 22.48,27.91 14.93,27.91 J5.P4
CB
  Top 0.254: U1.30 55.75,36.58 56.54,35.79 C14.1
CC
  Top 0.203: C15.1 56.38,25.56 56.38,32.54 53.84,35.08 U1.27
COAST  (via drill 0.35)
  Top 0.203: 46.66,42.02 46.66,41.03 U1.46 | 30.23,50.8 J1.P$11 29.34,50.67 | 16.69,32.69 16.69,30.93 16.89,30.73 v16.89,20.7
  Top 0.254: 46.66,42.02 46.38,42.3 45.35,42.3 43.96,43.69 37.34,43.69 30.23,50.8 | v22.35,47.24 24.57,49.47 28.13,49.47 29.34,50.67 | U$13.P$2 17.47,34.29 16.69,33.5 16.69,32.69
  Bottom 0.203: v16.89,20.7 16.89,11.94 16.89,7.33 COAST.1
  Bottom 0.254: U$13.P$2 22.35,38.73 v22.35,47.24 | R33.1 15.11,10.16 16.89,11.94
  other vias: 17.91,6.31 11.14,10.16
CSOUT
  Top 0.203: U1.19 48.66,32.67 48.66,33.41 48,34.07 45.62,34.07 35.94,24.38
  Top 0.254: 35.94,24.38 27.81,24.38 J1.P$14
DIR  (via drill 0.35)
  Top 0.203: U1.9 43.19,35.58 42.61,35 40.39,35 39.84,34.46 39.84,34.37 39.5,34.02 v39.5,33.54 | 24,41.91 26.54,44.45 v28.03,44.45
  Top 0.254: 24,41.91 U$13.P$5 13.84,37.85 13.84,31.75 13.84,15.88 19.56,10.16 26.8,10.16 29.34,7.62 DIR.1
  Bottom 0.203: J1.P$10 29.34,47.07 28.03,45.76 v28.03,44.45 28.03,37.56 28.79,36.79 31.67,36.79 35.44,33.02 37.22,33.02 37.59,33.39 37.59,33.4 39.36,33.4 v39.5,33.54
DIRO  (via drill 0.35)
  Top 0.203: U1.44 47.64,40.23 47.38,39.98 45.37,39.98 44.15,41.19 39.78,41.19 39.32,41.66 29.01,41.66 28.38,41.03 28.38,40.24 28.94,39.69 29.1,39.69 30.29,38.49 30.29,36.51 J1.P$5 | 24.62,37.15 27.75,37.15 | v20.45,40.64 21.13,40.64
  Top 0.254: 27.75,37.15 J1.P$5 | 21.13,40.64 24.62,37.15 | v31.11,19.43 31.11,15.11 36.96,9.27 DIRO.1
  Bottom 0.203: U$13.P$7 19.18,46.99 20.45,45.72 v20.45,40.64
  Bottom 0.254: J1.P$5 31.11,33.78 v31.11,19.43
FF1  (via drill 0.35)
  Top 0.203: U1.6 43.18,37.08 42.16,36.07 39.64,36.07 v38.5,34.92 | R31.1 37.97,39.04 37.23,39.78 34.32,39.78 32.26,37.72 v32.26,35.18
  Bottom 0.203: v38.5,34.92 38,34.92 36.82,36.11 36.82,37.75 R31.1 | FF1.2 45.53,8.79 41.88,8.79 32.26,18.41 v32.26,35.18
  other vias: 37.97,38.9 48.39,5.93
FF2  (via drill 0.35)
  Top 0.203: U1.5 43.05,37.58 41.92,36.45 37.85,36.45 v36.32,34.92 | R30.1 33.15,36.62 v33.15,34.29
  Bottom 0.203: v36.32,34.92 36.32,38.27 R30.1 | FF2.2 47.2,9.65 42.79,9.65 33.15,19.3 v33.15,34.29
  other vias: 35.56,39.03 50.93,5.93
GH_A  (via drill 0.35)
  Top 0.254: U1.32 56.82,37.58 v57.42,36.98
  Bottom 0.254: R16.1 60.83,52.07 58.55,49.78 58.55,37.72 57.81,36.98 v57.42,36.98
GH_A_T
  Bottom 0.813: R16.2 64.16,57.27 | Q_AH.P$4 64.16,57.27 | 64.16,57.27 64.13,57.3 GATE_HA.1
GH_B  (via drill 0.35)
  Top 0.254: U1.29 54.85,36.08 v55.12,35.81
  Bottom 0.254: v55.12,35.81 61.06,35.81 R18.1
GH_B_T
  Bottom 0.813: R18.2 64.16,40.64 64.16,40.76 | 64.16,40.76 Q_BH.P$4 | 64.16,40.76 64.16,45.7 GATE_HB.1
GH_C  (via drill 0.35)
  Top 0.254: U1.26 53.38,34.58 54.17,33.79 v54.23,33.79
  Bottom 0.254: R20.1 54.94,22.12 54.94,31.04 54.21,31.77 54.21,32.78 54.23,32.81 v54.23,33.79
GH_C_T
  Bottom 0.813: R20.2 59.46,19.55 64.16,24.25 | Q_CH.P$4 64.16,24.25 | 64.16,24.25 62.74,25.68 GATE_HC.1
GL_A  (via drill 0.35)
  Top 0.203: U1.36 56.59,39.58 56.63,39.62 60.07,39.62 v61.72,41.27 | v62.74,44.32 62.61,44.2
  Top 0.254: 62.61,44.2 63.25,44.83
  Top 0.508: 63.25,44.83 63.75,45.34
  Top 0.61: 63.75,45.34 R17.1
  Bottom 0.203: v61.72,41.27 61.72,43.31 v62.74,44.32
  other vias: 76.94,45.34
GL_A_T
  Bottom 0.813: R17.2 88.65,45.34 89.8,46.49 89.8,46.99 | 89.8,46.99 Q_AL.P$4 | 89.8,46.99 91.69,46.99 GATE_LA.1
GL_B  (via drill 0.35)
  Top 0.254: U1.35 64.04,39.08 v65.41,37.72
  Bottom 0.254: v65.41,37.72 65.41,30.86 67.18,29.08 73.79,29.08 | 75.95,29.08 76.05,29.08 R19.1
  Bottom 0.406: 73.79,29.08 75.95,29.08
GL_B_T
  Bottom 0.813: R19.2 81.79,29.46 82.3,28.96 88.52,28.96 90.05,30.49 Q_BL.P$4
  Bottom 1.016: R19.2 78.99,29.74 GATE_LB.1
GL_C  (via drill 0.35)
  Top 0.254: U1.34 61.88,38.58 62.74,37.72 v62.74,36.96 | v60.71,30.99 59.44,29.72 59.44,15.24 62.87,11.81 R21.1
  Bottom 0.254: v62.74,36.96 62.74,33.02 v60.71,30.99
  other vias: 74.91,11.81
GL_C_T
  Bottom 1.016: R21.2 86.49,11.81 | 86.49,11.81 89.92,11.81 GATE_LC.1 90.17,13.97 | 90.17,13.97 90.17,16.05 Q_CL.P$4 | 86.49,11.81 88.65,13.97 90.17,13.97
GND  (via drill 0.35)  (1 unrouted)
  Top 0.203: U1.21 49.64,28.94 v49.4,27.94 | v51.69,27.94 v55.74,27.94 | v101.73,23.4 101.73,22.49 C18.2
  Bottom 0.203: v49.4,27.94 v51.69,27.94 | C28.2 101.73,24.12 v101.73,23.4
  Bottom 0.254: C18.2 C16.2 101.2,12.76 J3.P$5
  Bottom 1.016: U$13.P$8 38.23,69.85 C3.2 43.43,69.98 DECOUP.2
  other vias: 55.52,40.89 101.2,21.97 105.54,41.91 104.27,41.91 103,41.91 101.73,41.91 100.46,41.91 100.46,43.18 101.73,43.18 103,43.18 104.27,43.18 105.54,43.18 105.54,44.45 104.27,44.45 103,44.45 101.73,44.45 100.46,44.45 100.46,45.72 101.73,45.72 103,45.72 104.27,45.72 105.54,45.72 105.54,46.99 104.27,46.99 103,46.99 101.73,46.99 100.46,46.99 99.19,48.26 100.46,48.26 101.73,48.26 103,48.26 104.27,48.26 105.54,48.26 86.49,52.07 86.49,51.05 87.76,52.07 87.76,51.05 89.03,52.07 89.03,51.05 90.3,52.07 90.3,51.05 91.19,51.56 91.44,50.55 91.57,49.53 92.96,46.1 93.85,45.34 93.98,44.32 94.11,42.93 95.12,42.93 95,44.32 96.27,42.93 96.14,44.2 97.28,44.07 97.28,42.93 94.49,46.86 94.87,45.72 96.14,45.34 97.28,45.34 96.65,46.23 95.63,46.86 77.6,58.42 77.6,57.15 77.6,55.88 77.6,54.61 77.6,53.34 77.6,52.07 77.6,50.8 77.6,49.53 77.6,48.26 77.6,46.99 78.87,46.99 78.87,48.26 78.87,49.53 78.87,50.8 78.87,52.07 78.87,53.34 78.87,54.61 78.87,55.88 78.87,57.15 78.87,58.42 80.14,58.42 80.14,57.15 80.14,55.88 80.14,54.61 80.14,53.34 80.14,52.07 80.14,49.53 80.14,50.8 80.14,48.26 80.14,46.99 76.33,40.64 77.6,41.91 78.87,41.91 77.6,40.64 78.87,40.64 77.6,39.37 77.6,38.1 77.6,36.83 78.87,36.83 78.87,38.1 78.87,39.37 80.14,41.91 80.14,40.64 80.14,39.37 80.14,38.1 80.14,36.83 77.6,25.4 77.6,24.13 77.6,22.86 77.6,21.59 77.6,20.32 77.6,19.05 77.6,17.78 77.6,16.51 77.6,15.24 78.87,15.24 78.87,16.51 78.87,17.78 78.87,19.05 78.87,20.32 78.87,21.59 78.87,22.86 78.87,24.13 78.87,25.4 80.14,25.4 80.14,24.13 80.14,22.86 80.14,21.59 80.14,20.32 80.14,19.05 80.14,17.78 80.14,16.51 80.14,15.24
  pour Top: 101.73,64.77 98.81,64.77 94.23,69.34 93.6,69.98 73.15,69.98 69.47,73.66 40.77,73.66 40.77,58.42 53.72,45.47 53.72,41.66 54.74,40.64 54.74,12.7 59.82,7.62 104.27,7.62 106.81,10.16 106.81,59.69
H1  (via drill 0.35)
  Top 0.203: 90.79,7.62 59.82,7.62 56.01,11.43 44.58,11.43 39.13,16.88 v39.13,23.35 | v38.86,29.72 40.76,31.62 40.76,32.63 40.75,32.65 43.19,35.08 U1.10
  Top 0.254: J3.P$3 90.79,7.62
  Bottom 0.203: v39.13,23.35 38.86,23.62 v38.86,29.72
  Bottom 0.254: J3.P$3 97.92,17.77 C16.1
H2  (via drill 0.35)
  Top 0.203: v39.62,25.78 39.62,26.16 42.48,29.02 v42.48,30.03 | U1.11 43.31,34.58 42.99,34.26 v42.99,32.33
  Bottom 0.203: J3.P$2 97.92,12.91 96.49,14.34 | v39.62,25.78 39.62,23.75 39.76,23.61 39.76,17.51 42.8,14.48 53.98,14.48 60.07,8.38 95.75,8.38 | v42.99,32.33 44.07,31.25 44.07,30.72 43.7,30.35 42.8,30.35 v42.48,30.03
  Bottom 0.254: 96.49,14.34 96.49,19 C18.1 | J3.P$2 95.75,8.38
H3  (via drill 0.35)
  Top 0.203: 58.78,6.38 54.74,10.41 v44.32,10.41 | v43.44,13.59 43.44,27.66 v43.5,27.72 | v45.65,28.83 45.65,30.4 v45.58,30.48 | v43.7,33.27 43.7,33.57 U1.12
  Top 0.254: J3.P$6 100.14,14.75 91.77,6.38 58.78,6.38
  Bottom 0.203: C28.1 101.33,22.77 101.83,22.77 103.42,21.18 | v43.44,13.59 43.44,12.33 43.43,12.32 43.43,11.3 v44.32,10.41 | v43.5,27.72 43.77,28 43.77,28.58 44.02,28.83 v45.65,28.83 | v45.58,30.48 43.7,32.36 v43.7,33.27
  Bottom 0.254: J3.P$6 103.42,21.18
LSS  (via drill 0.35)  (3 unrouted)
  Top 0.203: 50.18,24.13 49.8,23.75 C7.1 | 50.18,31.5 50.18,33.47 50.39,33.69 50.6,33.69 51.14,34.23 51.14,39.44 50.64,39.94 U1.38
  Top 0.254: U1.22 50.14,31.54 50.18,31.5 50.18,24.13 50.18,22.47 v58.04,14.61
  Top 0.406: C23.2 84.87,33.55 Q_BL.P$12 | C21.2 84.74,50.32 Q_AL.P$12
  Top 0.61: 92.84,22.86 93.22,22.48 SOURCE_TEST.1
  Top 0.813: v87.12,30.1 87.25,29.97 91.95,29.97 | 91.95,29.97 92.84,29.08 92.84,22.86 92.84,20.95 89.05,17.17 Q_CL.P$12 84.99,17.42 C25.2 82.55,16.79 R15.2 | v86.49,46.61 87.5,45.59 91.69,45.59 92.84,44.45 92.84,30.86 91.95,29.97
  Bottom 0.254: v58.04,14.61 63.14,14.61 64.43,13.31 80,13.31 Q_CL.P$10
  Bottom 0.813: Q_BL.P$7 86.45,30.77 v87.12,30.1 | Q_AL.P$7 86.49,48.77 v86.49,46.61 | Q_AL.P$11 Q_AL.P$10 Q_AL.P$9 Q_AL.P$8 Q_AL.P$7 | Q_AL.P$7 Q_AL.P$6 Q_AL.P$5 | Q_BL.P$11 Q_BL.P$10 Q_BL.P$9 Q_BL.P$8 Q_BL.P$7 | Q_BL.P$7 Q_BL.P$6 Q_BL.P$5 | Q_CL.P$11 Q_CL.P$10 Q_CL.P$9 Q_CL.P$8 Q_CL.P$7 Q_CL.P$6 Q_CL.P$5
  other vias: 85.25,17.17 85.25,33.17 85,50.06 48.73,23.75 95,22.48
M_A  (via drill 0.35, 0.55)  (1 unrouted)
  Top 0.203: 82.8,53.47 C21.1 83.08,53.59 | v59.79,44.96 59.79,55.47 59.87,55.55
  Top 0.254: U1.31 56.39,37.08 57.15,36.32 58.56,36.32 v59.79,37.56
  Top 0.406: C20.2 71.85,58.4 71.54,58.71 Q_AH.P$12
  Top 0.813: 71.54,58.71 68.37,55.55 59.87,55.55 C13.2
  Top 1.016: 75.56,59.78 76.03,60.26 80.84,60.26 | 80.84,60.26 Q_AL.P$1 | 80.84,60.26 82.8,58.29 C21.1 84.3,54.81 Q_AL.P$3
  Top 1.27: C20.2 75.56,59.78
  Bottom 0.203: v59.79,37.56 v59.79,44.96
  Bottom 0.813: Q_AH.P$5 Q_AH.P$6 Q_AH.P$7 Q_AH.P$8 Q_AH.P$9 Q_AH.P$10 Q_AH.P$11
  Bottom 1.016: Q_AL.P$3 87.9,54.81 88.9,55.82 98.57,46.15 J2.P$4 | Q_AL.P$1 Q_AL.P$2
  other vias: 71.47,58.78 85.6,60.26 85.6,54.81
M_B  (via drill 0.35, 0.55, 0.6)  (1 unrouted)
  Top 0.203: 71.54,42.2 Q_BH.P$12
  Top 0.254: U1.28 54.23,35.58 v55.19,34.62
  Top 0.406: C23.1 83.06,36.83 | C22.2 71.72,42.01 71.54,42.2
  Top 0.61: C14.2 64.13,34.8 71.47,42.13 Q_BH.P$12
  Top 1.016: 85.22,43.37 85.15,43.37 83.06,41.27 C23.1 84.49,36.55 Q_BL.P$3 | Q_BL.P$1 Q_BL.P$2
  Top 1.27: C22.2 75.78,43.37 85.22,43.37 Q_BL.P$1
  Bottom 0.254: v55.19,34.62 59.36,34.62 C14.2
  Bottom 0.813: Q_BH.P$5 Q_BH.P$6 Q_BH.P$7 Q_BH.P$8 Q_BH.P$9 Q_BH.P$10 Q_BH.P$11
  Bottom 1.016: Q_BL.P$3 87.85,37.92 91.37,34.4 101.62,34.4 J2.P$1
  other vias: 59.54,34.8 85.85,43.37 71.47,42.27 85.85,41.22 85.85,37.92
M_C  (via drill 0.35, 0.55, 0.6)
  Top 0.203: U1.25 54.13,32.51 v54.86,32.51 | Q_CH.P$12 Q_CH.P$8
  Top 0.406: C24.2 71.85,25.38 Q_CH.P$12
  Top 0.813: C15.2 62.69,25.76 Q_CH.P$12
  Top 1.016: Q_CL.P$1 83.57,25.08 83.57,20.8 C25.1 84.68,21.92 Q_CL.P$3
  Top 1.27: C24.2 76.16,27.37 Q_CL.P$1
  Bottom 0.203: v54.86,32.51 57.79,32.51 60.94,29.36 C15.2
  Bottom 0.813: Q_CH.P$5 Q_CH.P$6 Q_CH.P$7 Q_CH.P$8 Q_CH.P$9 Q_CH.P$10 Q_CH.P$11
  Bottom 1.016: Q_CL.P$2 86.49,25.22 | 86.49,25.22 92.03,25.22 J2.P$2 | Q_CL.P$1 85.85,25.85 86.49,25.22
  other vias: 71.47,25.76 60.94,24 85.85,27.37 71.47,26.76 85.85,21.92
MODE  (via drill 0.35)
  Top 0.203: U1.15 46.66,32.63 46.66,31.62 46.15,31.11 44.83,31.11 42.93,29.21 42.93,28.17 37.62,22.86 21.72,22.86
  Top 0.254: U$13.P$1 17.91,26.67 21.72,22.86 21.72,20.57 v19.56,18.41 | v17.53,10.67 17.53,9.74 MODE.1
  Bottom 0.203: 23.11,52.2 25.53,54.61 | 28.07,54.61 J1.P$13
  Bottom 0.254: U$13.P$1 21.72,31.75 23.11,33.15 23.11,52.2 | 25.53,54.61 28.07,54.61 | v19.56,18.41 17.53,16.38 v17.53,10.67
N$1  (via drill 0.35)
  Top 0.254: R3.2 18.54,53.98 v17.91,53.34 | v20.45,38.1 22.99,35.56 J1.P$18
  Bottom 0.254: v17.91,53.34 15.37,50.8 15.37,39.98 17.33,38.02 20.37,38.02 v20.45,38.1
N$2  (via drill 0.35)
  Top 0.254: v23.88,51.44 17.56,51.44 R4.2
  Bottom 0.203: 24,51.31 v23.88,51.44
  Bottom 0.254: J1.P$19 26.04,38.1 24,40.13 24,51.31
N$3  (via drill 0.35)
  Top 0.203: U1.42 48.64,43.05 v48.77,43.18
  Bottom 0.152: 48.77,44.22 C10.1
  Bottom 0.203: v48.77,43.18 48.77,44.22
N$4  (via drill 0.35)
  Top 0.203: U1.43 48.14,42.56 v47.9,42.8
  Bottom 0.203: C10.2 46.89,43.43 47.52,42.8 v47.9,42.8
N$5  (via drill 0.35)
  Bottom 0.203: R10.1 FF1.1
  other vias: 48.39,4.23
N$13  (via drill 0.35)
  Top 0.203: 5V_LED.2 R5.2
  other vias: 40.39,42.08
N$18  (via drill 0.35)
  Top 0.203: FF2.1 R8.1
  other vias: 50.93,4.15
N$22  (via drill 0.35)
  Top 0.203: DIRO.2 R27.1
  other vias: 36.96,4.41
N$23  (via drill 0.35)  (1 unrouted)
  other vias: 33.15,4.41
N$24  (via drill 0.35)
  Top 0.203: MODE.2 R11.2
  other vias: 14.1,4.41
N$25  (via drill 0.35)
  Top 0.203: PWM.2 R12.2
  other vias: 21.72,4.41
N$26  (via drill 0.35)
  Top 0.203: DIR.2 R22.2
  other vias: 29.34,4.41
N$27  (via drill 0.35)
  Bottom 0.203: R23.2 25.53,4.53 BRAKE.2
  other vias: 25.53,4.61
N$28  (via drill 0.35)  (1 unrouted)
  other vias: 17.91,4.41
PWM  (via drill 0.35)
  Top 0.203: 46.16,32.63 U1.14 | 14.49,17.77 19.37,12.89 v20.32,11.94
  Top 0.254: v43.44,30.98 43.95,31.5 45.8,31.5 46.16,31.86 46.16,32.63 | v16,31.88 14.49,30.37 14.49,17.77 14.49,16.62 v14.6,16.51
  Top 0.305: 39.93,32.18 v40.13,32.38
  Top 0.61: 31.32,33.96 33.15,32.13 38.08,32.13 38.29,32.33 38.98,32.33 39.13,32.18 39.93,32.18 | 31.02,34.26 31.32,33.96 | J1.P$7 31.32,38.66 31.32,33.96 | U$13.P$3 19.19,36.83 21.77,34.26 30.61,34.26
  Top 1.016: 30.61,34.26 31.02,34.26
  Bottom 0.203: v16,31.88 16,34.92 U$13.P$3 | v20.32,11.94 21.72,10.54 PWM.1
  Bottom 0.254: R32.1 13.84,13.97 14.6,14.73 v14.6,16.51
  Bottom 0.305: v40.13,32.38 40.39,32.64 41.78,32.64 42.31,32.12 42.31,32.04 42.71,31.64 42.78,31.64 v43.44,30.98
  other vias: 21.72,6.31 11.14,13.97
Q_GND  (via drill 0.35)
  Bottom 0.203: C7.2 46.52,23.75 R14.2 44.58,26.89 R7.1 | C9.2 47.26,27.18 v48.78,27.18
  pour Bottom: 39.5,27.94 39.5,29.21 43.82,29.21 44.96,30.35 51.69,30.35 54.1,27.94 54.1,26.8 52.83,25.53 40.13,25.53 39.5,26.16
RC  (via drill 0.35)
  Top 0.203: U1.16 47.16,32.63 47.16,31.39 46.99,31.22 46.99,30.58 v46.74,30.33
  Bottom 0.152: R7.2 46.09,29.68 v46.74,30.33
  Bottom 0.203: v46.74,30.33 46.99,30.07 C9.1
RDEAD  (via drill 0.35)
  Top 0.203: U1.18 48.14,31.87 48.85,31.16 48.85,30.57 48.07,29.78 48.07,27.88 v48.13,27.81
  Bottom 0.203: R26.1 52.96,30.7 R25.2 50.8,30.48 v48.13,27.81
REF  (via drill 0.35)
  Top 0.203: U1.20 49.14,31.39 49.21,31.32 49.21,29.9 v48.82,29.52
  Bottom 0.203: v48.82,29.52 48.47,29.52 46.74,31.25 R29.1
RESET  (via drill 0.35)
  Top 0.203: U1.2 43.43,39.08 43.07,39.44 v43.07,40.26
  Bottom 0.203: R6.1 43.07,42.47 v43.07,40.26
TACHO  (via drill 0.35)
  Top 0.203: U1.7 43.18,36.58 42.31,35.71 39.79,35.71 39.13,35.05 39.13,34.66 38.76,34.29 35.56,34.29 | 12.19,22.73 v13.08,21.84
  Top 0.254: 35.56,34.29 v34.99,34.86 | v24.89,44.45 U$13.P$6 15.37,44.45 12.19,41.27 12.19,22.73 | v25.4,40.13 26.23,39.31 27.06,39.31 28.27,38.1 J1.P$6
  Bottom 0.203: v13.08,21.84 17.65,21.84 | 33.15,6.35 TACHO.1
  Bottom 0.254: v34.99,34.86 31.75,38.1 J1.P$6 | v24.89,44.45 25.4,43.94 v25.4,40.13 | 17.65,21.84 33.15,6.35
  other vias: 33.15,6.31
V_IN
  Top 0.61: J4.P1 10.29,27.94 10.29,38.56 J5.P1
VDD  (via drill 0.35, 0.55)  (1 unrouted)
  Top 0.203: 73.79,38.38 C22.1 73.51,38.1 | C20.1 73.38,54.61 | U1.45 47.14,41.8 | D5.C 93.35,72.39 v94.11,72.39
  Top 0.254: 48.01,43.94 62.1,43.94 v65.66,40.39 | U1.24 51.65,32.14 53.93,32.14 54.33,31.75 55.37,31.75 v55.63,31.5 | v60.2,28.7 65.41,28.7 v65.53,28.57 | R6.2 44.39,44.54 44.98,43.94 48.01,43.94 | U1.45 47.14,43.18 47.9,43.94 48.01,43.94
  Top 0.508: v65.53,28.57 69.03,32.07 Q_BH.P$1
  Top 1.016: C24.1 70.87,19.07 Q_CH.P$1 | C22.1 72.93,37.52 Q_BH.P$3 | C20.1 70.87,52.09 Q_AH.P$1
  Bottom 0.203: D5.C v92.84,72.39 | 68.58,69.98 C3.1
  Bottom 0.254: v55.63,31.5 57.4,31.5 v60.2,28.7
  Bottom 1.016: DECOUP.1 68.58,69.98
  other vias: 70.87,15.56 70.87,37.52 70.87,48.58 43.43,44.54 92.84,71.88 70.87,32.07
  pour Bottom: 100.46,73.66 68.71,73.66 64.9,69.85 64.9,13.97 66.17,12.7 76.33,12.7 77.6,13.97 77.6,60.96 80.14,63.5 87.76,63.5 89.03,64.77 101.73,64.77 101.73,72.39
VDSTH  (via drill 0.35)
  Top 0.203: 50.64,27.94 50.84,27.74 R13.2 | v47.12,24.78 48.1,23.8 48.1,23.49 48.39,23.2 VDSTH_TEST.1
  Top 0.254: U1.23 50.64,27.94
  Bottom 0.203: R13.2 45.94,26.54 R14.1 47.12,24.85 v47.12,24.78
  other vias: 50.84,26.54 48.39,20.32
VREG  (via drill 0.35)
  Top 0.203: v51.44,43.18 50.3,42.04 49.89,42.04 49.64,41.79 U1.40
  Bottom 0.203: v51.44,43.18 51.44,46.33 C11.1 49.89,51.08 VREG_TEST.1

### Text on the board
tPlace: Cornell Mars Rover | Nivant Desai | Battery Protection Diode | BLDC v2 2021-2022 | This board took ~3 years off of my lifespan | Electrolytic Decoupling Cap | FET Decoupling | CBootA | FET Decoupling | GND | Diro | Tacho | Dir | FF Pullups | FET Decoupling | Thermal Dissipation Vias | Logic Interface | Brake | A | PWM | Coast | FET Decoupling | CBootB | Mode | PWM/Coast Pulldown | 0 Ohm for RDEAD Pull up / DO NOT SOLDER BOTH R25 AND R26! | <-VDSTH Divider-> | C | B | FET Decoupling | CBootC | FET Decoupling | PWM pulldown | Coast pulldown | Sense Resistor | Debug LEDs for Logic Signals | Fault Flags - Should be off!
bPlace: Fet A Low | FET A Low | MODE | BRAKE | COAST | DIR | Charge Pump Cap | FET A High | Vreg Cap - req'd by DS | FET B Low | Reset Pullup | AGND->GND | PWM | TACHO | 5V Decoupling | Vref Resis., sets the current limit | A | BDCap | DIRO | AGND->CGND | AGND->QGND | 0 ohm | FET B High | C | B | RC Osc. Timer | Dead time Resis. / (400k = 3.3us) | FET C Low | Note: Source test will also give / voltage across sense resistor | CSOUT | FET C High | Hall Decoupling - Optional | LSS Decoupling | H1 | H3 | H2 | GND | 5V